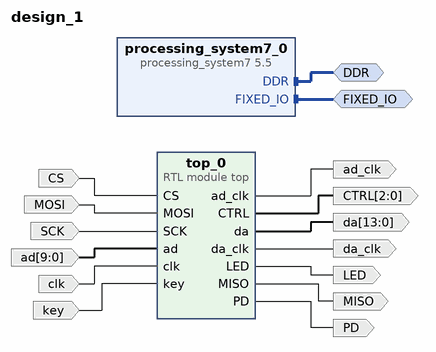
[diagram p0: block diagram of the top level]
# Vivado block design design_1, xc7z020clg400-1, Vivado 2022.2
create_bd_design design_1

create_bd_intf_port -mode Master -vlnv xilinx.com:interface:ddrx_rtl:1.0 DDR
create_bd_intf_port -mode Master -vlnv xilinx.com:display_processing_system7:fixedio_rtl:1.0 FIXED_IO
create_bd_port -dir O -from 13 -to 0 da
create_bd_port -dir O -type clk ad_clk
create_bd_port -dir O -type clk da_clk
create_bd_port -dir O PD
create_bd_port -dir O -from 2 -to 0 CTRL
create_bd_port -dir O MISO
create_bd_port -dir O LED
create_bd_port -dir I -type clk clk
create_bd_port -dir I -from 9 -to 0 ad
create_bd_port -dir I key
create_bd_port -dir I SCK
create_bd_port -dir I CS
create_bd_port -dir I MOSI

create_bd_cell -type ip -vlnv xilinx.com:ip:processing_system7:5.5 processing_system7_0
set_property -dict [list \
  CONFIG.PCW_EN_CLK0_PORT 0 \
  CONFIG.PCW_EN_RST0_PORT 0 \
  CONFIG.PCW_QSPI_GRP_SINGLE_SS_ENABLE 1 \
  CONFIG.PCW_QSPI_GRP_SINGLE_SS_IO {MIO 1 .. 6} \
  CONFIG.PCW_QSPI_PERIPHERAL_ENABLE 1 \
  CONFIG.PCW_QSPI_QSPI_IO {MIO 1 .. 6} \
  CONFIG.PCW_SINGLE_QSPI_DATA_MODE x4 \
  CONFIG.PCW_UIPARAM_DDR_BUS_WIDTH {16 Bit} \
  CONFIG.PCW_UIPARAM_DDR_PARTNO {MT41K256M16 RE-125} \
  CONFIG.PCW_USE_M_AXI_GP0 0 \
] [get_bd_cells processing_system7_0]
# 50 more settings of processing_system7_0 are not shown: defaults, MIO pin electricals, DDR timing, and values the tool derives
create_bd_cell -type module -reference top top_0

# ---- connections ----

connect_bd_intf_net [get_bd_intf_ports DDR] [get_bd_intf_pins processing_system7_0/DDR]
connect_bd_intf_net [get_bd_intf_ports FIXED_IO] [get_bd_intf_pins processing_system7_0/FIXED_IO]
connect_bd_net -net CS_0_1 [get_bd_ports CS] [get_bd_pins top_0/CS]
connect_bd_net -net MOSI_0_1 [get_bd_ports MOSI] [get_bd_pins top_0/MOSI]
connect_bd_net -net SCK_0_1 [get_bd_ports SCK] [get_bd_pins top_0/SCK]
connect_bd_net -net ad_0_1 [get_bd_ports ad] [get_bd_pins top_0/ad]
connect_bd_net -net clk_0_1 [get_bd_ports clk] [get_bd_pins top_0/clk]
connect_bd_net -net key_0_1 [get_bd_ports key] [get_bd_pins top_0/key]
connect_bd_net [get_bd_pins top_0/CTRL] [get_bd_ports CTRL]
connect_bd_net [get_bd_pins top_0/LED] [get_bd_ports LED]
connect_bd_net [get_bd_pins top_0/MISO] [get_bd_ports MISO]
connect_bd_net [get_bd_pins top_0/PD] [get_bd_ports PD]
connect_bd_net [get_bd_pins top_0/ad_clk] [get_bd_ports ad_clk]
connect_bd_net [get_bd_pins top_0/da] [get_bd_ports da]
connect_bd_net [get_bd_pins top_0/da_clk] [get_bd_ports da_clk]

validate_bd_design
save_bd_design
